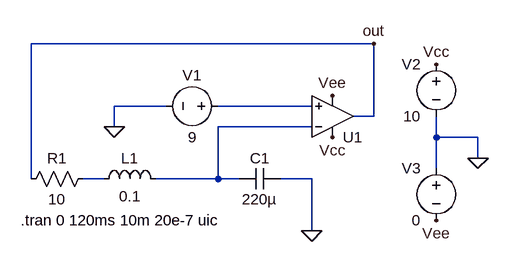
[diagram p0: schematic Circuito_onoff_ltspice.asc]
Circuito_onoff_ltspice.asc, the LTspice schematic file:
Version 4.1
SHEET 1 900 680
WIRE 720 -80 192 -80
WIRE 400 16 320 16
WIRE 624 16 480 16
WIRE 720 32 720 -80
WIRE 720 32 688 32
WIRE 320 48 320 16
WIRE 624 48 480 48
WIRE 816 64 816 32
WIRE 880 64 816 64
WIRE 880 96 880 64
WIRE 816 112 816 64
WIRE 192 128 192 -80
WIRE 304 128 272 128
WIRE 480 128 480 48
WIRE 480 128 384 128
WIRE 512 128 480 128
WIRE 624 128 576 128
WIRE 624 208 624 128
FLAG 320 48 0
FLAG 624 208 0
FLAG 880 96 0
FLAG 656 0 Vee
FLAG 816 192 Vee
FLAG 656 64 Vcc
FLAG 816 -48 Vcc
FLAG 720 -80 out
SYMBOL res 288 112 R90
WINDOW 0 0 56 VBottom 2
WINDOW 3 32 56 VTop 2
SYMATTR InstName R1
SYMATTR Value 10
SYMBOL cap 512 144 R270
WINDOW 0 32 32 VTop 2
WINDOW 3 0 32 VBottom 2
SYMATTR InstName C1
SYMATTR Value 220µ
SYMBOL ind 288 144 R270
WINDOW 0 32 56 VTop 2
WINDOW 3 5 56 VBottom 2
SYMATTR InstName L1
SYMATTR Value 0.1
SYMBOL voltage 496 16 R90
WINDOW 0 -32 56 VBottom 2
WINDOW 3 32 56 VTop 2
WINDOW 123 0 0 Left 0
WINDOW 39 0 0 Left 0
SYMATTR InstName V1
SYMATTR Value 9
SYMBOL voltage 816 -64 M0
SYMATTR InstName V2
SYMATTR Value 10
SYMBOL voltage 816 96 M0
SYMATTR InstName V3
SYMATTR Value 0
SYMBOL OpAmps\\UniversalOpAmp2 656 32 M180
SYMATTR InstName U1
TEXT 176 192 Left 2 !.tran 0 120ms 10m 20e-7 uic

The netlist it stands for:
* Circuito_onoff_ltspice.asc
R1 N003 out 10
C1 N002 0 220µ
L1 N003 N002 0.1
V1 N001 0 9
V2 Vcc 0 10
V3 0 Vee 0
X§U1 N001 N002 Vcc Vee out level2 Avol=1Meg GBW=10Meg Slew=10Meg Ilimit=25m Rail=0 Vos=0 En=0 Enk=0 In=0 Ink=0 Rin=500Meg  ; pins In+ In- V+ V- OUT
.tran 0 120ms 10m 20e-7 uic
.lib UniversalOpAmp2.lib
.backanno
.end